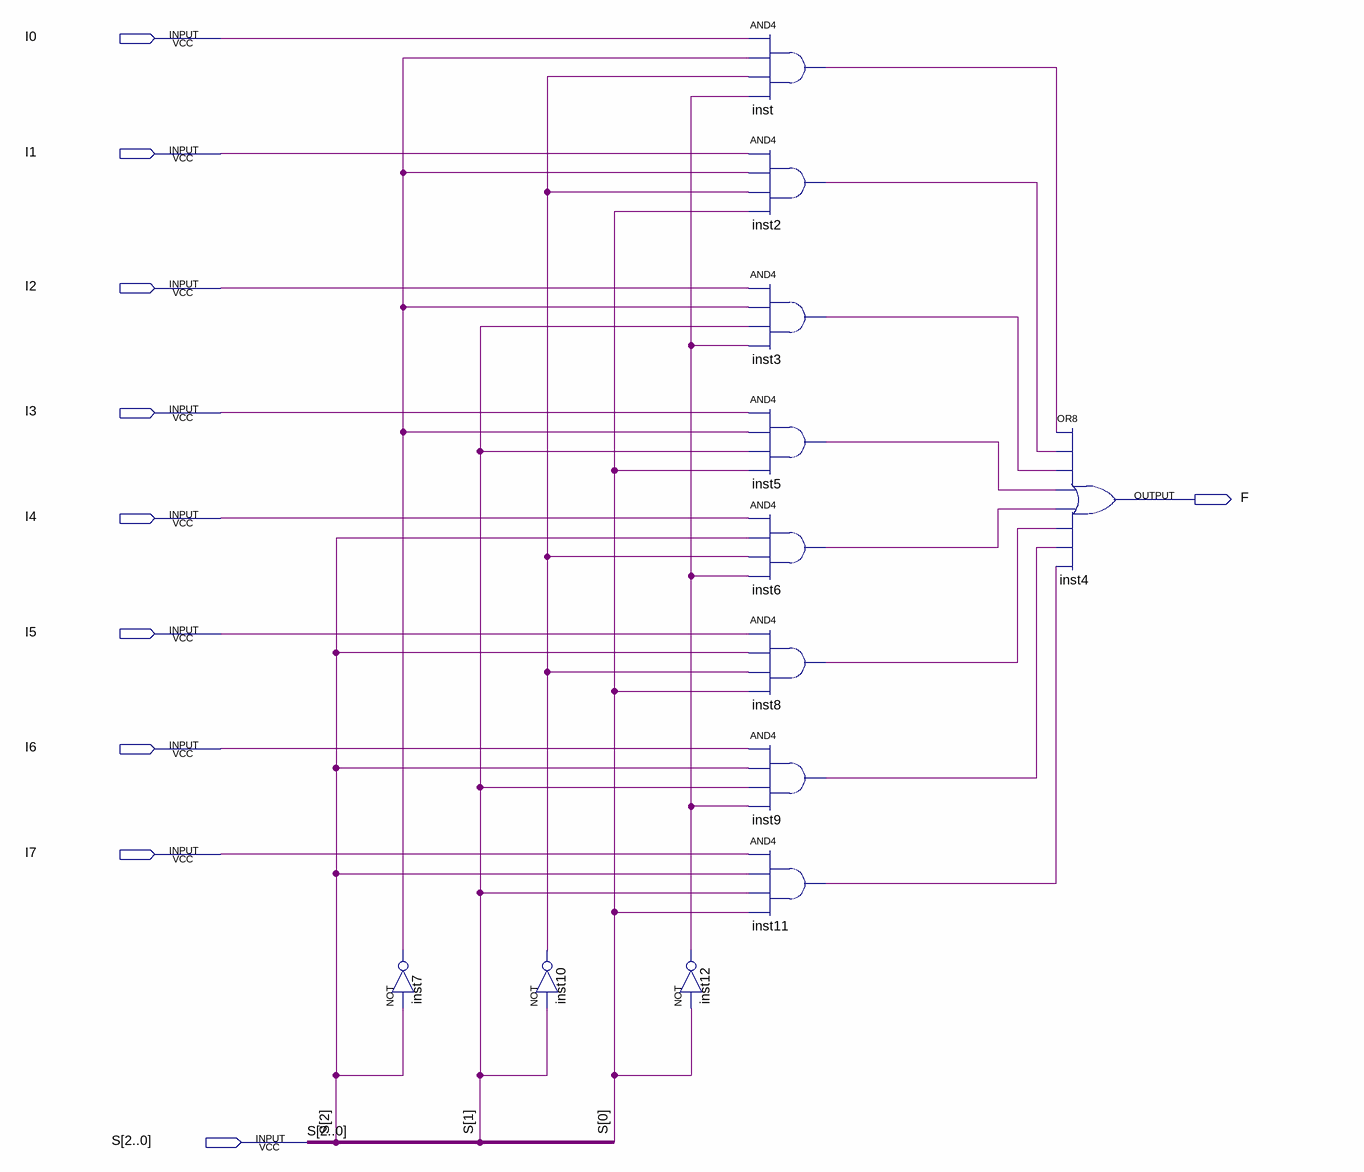
[diagram p0: schematic sheet]
// Quartus schematic 8to1Mux.bdf as structural Verilog: 12 symbols, 10 pins
module \8to1Mux  (
  input  I0,
  input  I1,
  input  I2,
  input  I3,
  input  I4,
  input  I5,
  input  I6,
  input  I7,
  input  [2:0] S,
  output F
);

  wire inst2_out, inst3_out, inst5_out, inst6_out, inst7_out, inst8_out, inst9_out, inst10_out, inst11_out,
       inst12_out, inst_out;

  not inst7 (inst7_out, S[2]);
  not inst10 (inst10_out, S[1]);
  not inst12 (inst12_out, S[0]);
  and inst (inst_out, I0, inst7_out, inst10_out, inst12_out);
  and inst2 (inst2_out, I1, inst7_out, inst10_out, S[0]);
  and inst3 (inst3_out, I2, inst7_out, S[1], inst12_out);
  and inst5 (inst5_out, I3, inst7_out, S[1], S[0]);
  and inst6 (inst6_out, I4, S[2], inst10_out, inst12_out);
  and inst8 (inst8_out, I5, S[2], inst10_out, S[0]);
  and inst9 (inst9_out, I6, S[2], S[1], inst12_out);
  and inst11 (inst11_out, I7, S[2], S[1], S[0]);
  or inst4 (F, inst_out, inst2_out, inst3_out, inst5_out, inst6_out, inst8_out, inst9_out, inst11_out);
endmodule
